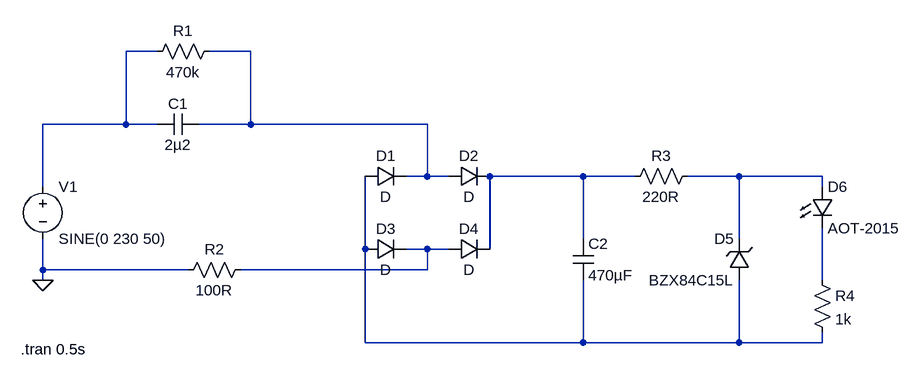
[diagram p0: schematic Draft2.asc]
Draft2.asc, the LTspice schematic file:
Version 4
SHEET 1 1260 680
WIRE 112 -80 64 -80
WIRE 256 -80 192 -80
WIRE 64 32 64 -80
WIRE 64 32 -64 32
WIRE 112 32 64 32
WIRE 256 32 256 -80
WIRE 256 32 176 32
WIRE 528 32 256 32
WIRE 528 112 528 32
WIRE 528 112 496 112
WIRE 560 112 528 112
WIRE 768 112 624 112
WIRE 848 112 768 112
WIRE 1008 112 928 112
WIRE 1136 112 1008 112
WIRE -64 128 -64 32
WIRE 1136 128 1136 112
WIRE 768 208 768 112
WIRE 1008 208 1008 112
WIRE 432 224 432 112
WIRE 528 224 496 224
WIRE 560 224 528 224
WIRE 624 224 624 112
WIRE -64 256 -64 208
WIRE 160 256 -64 256
WIRE 528 256 528 224
WIRE 528 256 240 256
WIRE -64 272 -64 256
WIRE 1136 272 1136 192
WIRE 432 368 432 224
WIRE 768 368 768 272
WIRE 768 368 432 368
WIRE 1008 368 1008 272
WIRE 1008 368 768 368
WIRE 1136 368 1136 352
WIRE 1136 368 1008 368
FLAG -64 272 0
SYMBOL voltage -64 112 R0
WINDOW 123 0 0 Left 2
WINDOW 39 0 0 Left 2
SYMATTR InstName V1
SYMATTR Value SINE(0 230 50)
SYMBOL cap 176 16 R90
WINDOW 0 0 32 VBottom 2
WINDOW 3 32 32 VTop 2
SYMATTR InstName C1
SYMATTR Value 2µ2
SYMATTR SpiceLine V=400
SYMBOL res 208 -96 R90
WINDOW 0 0 56 VBottom 2
WINDOW 3 32 56 VTop 2
SYMATTR InstName R1
SYMATTR Value 470k
SYMATTR SpiceLine pwr=1
SYMBOL res 256 240 R90
WINDOW 0 0 56 VBottom 2
WINDOW 3 32 56 VTop 2
SYMATTR InstName R2
SYMATTR Value 100R
SYMATTR SpiceLine pwr=1
SYMBOL diode 432 128 R270
WINDOW 0 32 32 VTop 2
WINDOW 3 0 32 VBottom 2
SYMATTR InstName D1
SYMBOL diode 560 128 R270
WINDOW 0 32 32 VTop 2
WINDOW 3 0 32 VBottom 2
SYMATTR InstName D2
SYMBOL diode 432 240 R270
WINDOW 0 32 32 VTop 2
WINDOW 3 0 32 VBottom 2
SYMATTR InstName D3
SYMBOL diode 560 240 R270
WINDOW 0 32 32 VTop 2
WINDOW 3 0 32 VBottom 2
SYMATTR InstName D4
SYMBOL cap 752 208 R0
SYMATTR InstName C2
SYMATTR Value 470µF
SYMATTR SpiceLine V=100V
SYMBOL res 944 96 R90
WINDOW 0 0 56 VBottom 2
WINDOW 3 32 56 VTop 2
SYMATTR InstName R3
SYMATTR Value 220R
SYMATTR SpiceLine pwr=1
SYMBOL zener 1024 272 R180
WINDOW 0 24 64 Left 2
WINDOW 3 24 0 Left 2
SYMATTR InstName D5
SYMATTR Value BZX84C15L
SYMATTR Description Schottky diode
SYMATTR Type schottky
SYMBOL LED 1120 128 R0
SYMATTR InstName D6
SYMATTR Value AOT-2015
SYMBOL res 1120 256 R0
SYMATTR InstName R4
SYMATTR Value 1k
TEXT -98 378 Left 2 !.tran 0.5s

The netlist it stands for:
* Draft2.asc
V1 N001 0 SINE(0 230 50)
C1 N002 N001 2µ2 V=400
R1 N002 N001 470k pwr=1
R2 N006 0 100R pwr=1
D1 N005 N002 D
D2 N002 N003 D
D3 N005 N006 D
D4 N006 N003 D
C2 N003 N005 470µF V=100V
R3 N004 N003 220R pwr=1
D5 N005 N004 BZX84C15L
D6 N004 N007 AOT-2015
R4 N007 N005 1k
.model D D
.lib standard.dio
.tran 0.5s
.backanno
.end